# EAGLE design Grove - Magnetic Switch v1.3 (EAGLE 6.5.0)

## Sheet 1 of 2
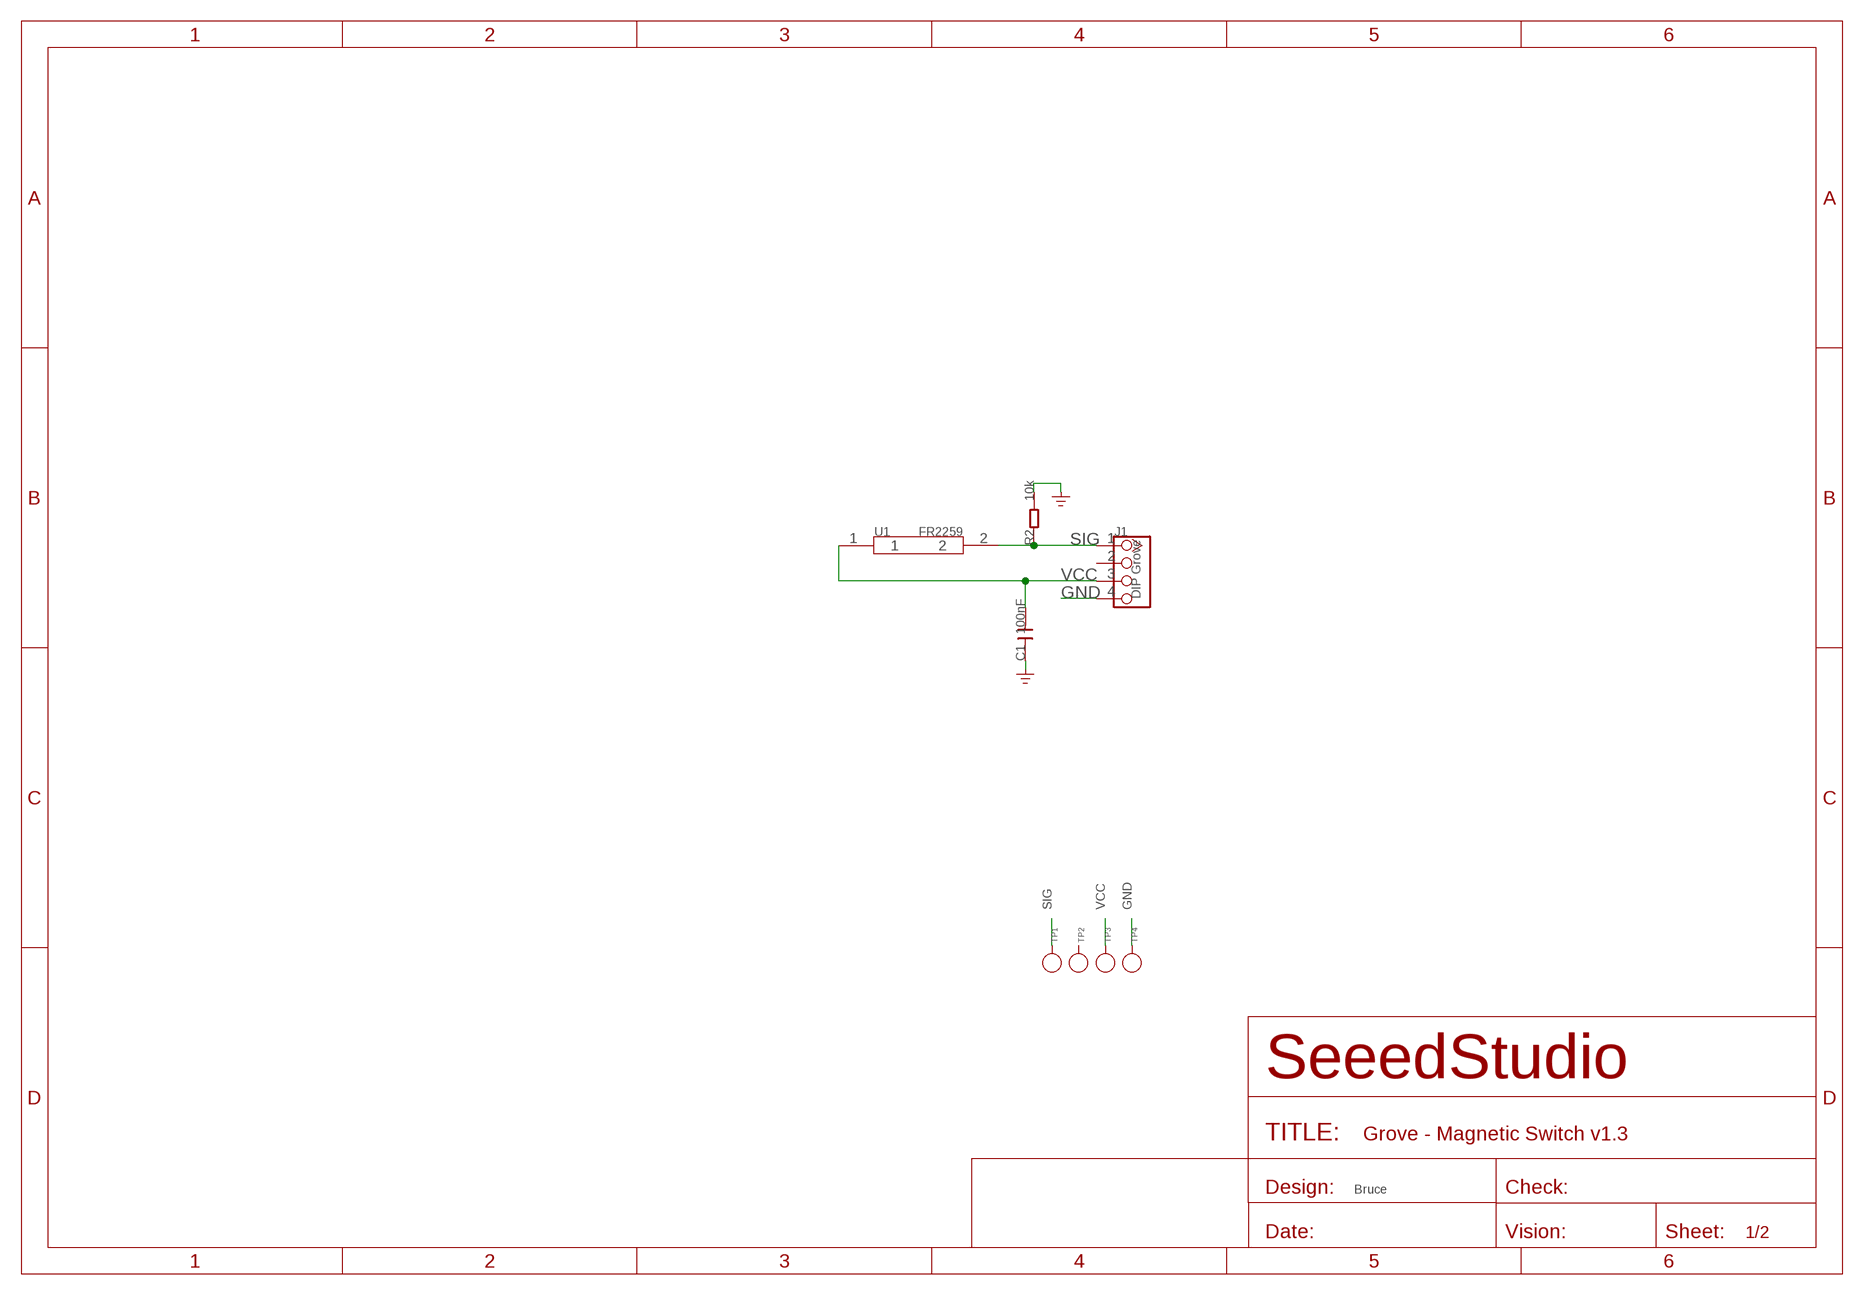
[diagram p0: schematic, sheet 1]

### Parts
C1  100nF  C-0603  [C0603]
J1  DIP Grove  TWIG-4P-2.0-2.0  [4P-2.0]
R2  10k  R-0603  [R0603]
TP1  PAD-TEST-POINT'4545'  [TP_4545]
TP2  PAD-TEST-POINT'4545'  [TP_4545]
TP3  PAD-TEST-POINT'4545'  [TP_4545]
TP4  PAD-TEST-POINT'4545'  [TP_4545]
U1  FR2259  MAGNETISM  [MAGNETISM]

### Nets
GND: C1.1 J1.4 R2.2 TP4.T
SIG: J1.1 R2.1 TP1.T U1.2
VCC: C1.2 J1.3 TP3.T U1.1
Unconnected: J1.2 TP2.T

### Notes on the sheet
- Bruce

## Sheet 2 of 2
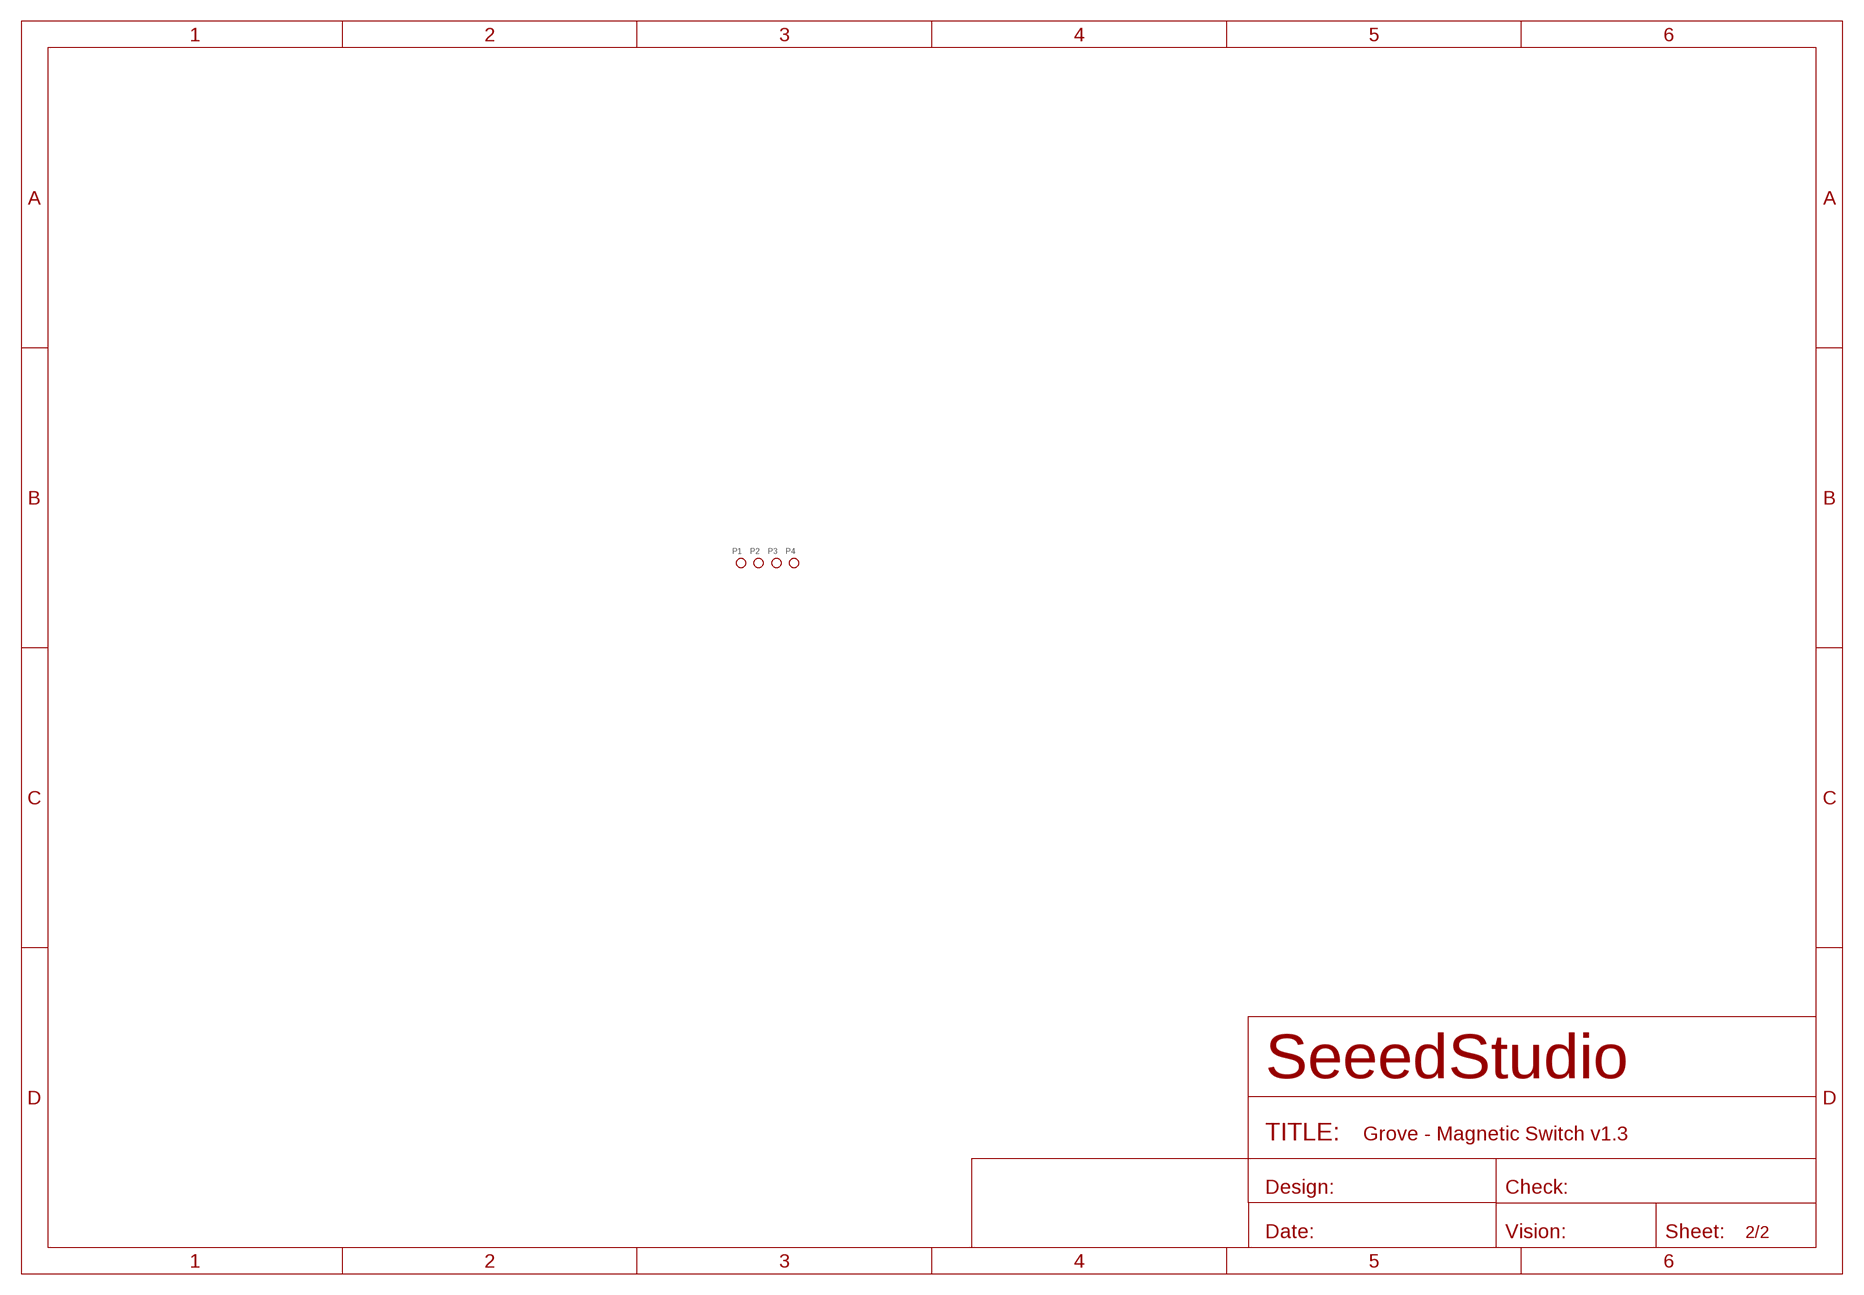
[diagram p1: schematic, sheet 2]

### Parts
P1  PAD-MARK  [ROUND-MARK-1.0]
P2  PAD-MARK  [ROUND-MARK-1.0]
P3  PAD-MARK  [ROUND-MARK-1.0]
P4  PAD-MARK  [ROUND-MARK-1.0]

## Library data of the parts
C1 = Discrete:C*: Ceramic Capacitors
J1 = Connector:TWIG-4P-2.0
P1-P4 = Discrete:PAD-MARK; PARTNO: DNP
R2 = Discrete:R*
TP1-TP4 = Discrete:PAD-TEST-POINT; PARTNO: DNP
U1 = template:MAGNETISM

## Board
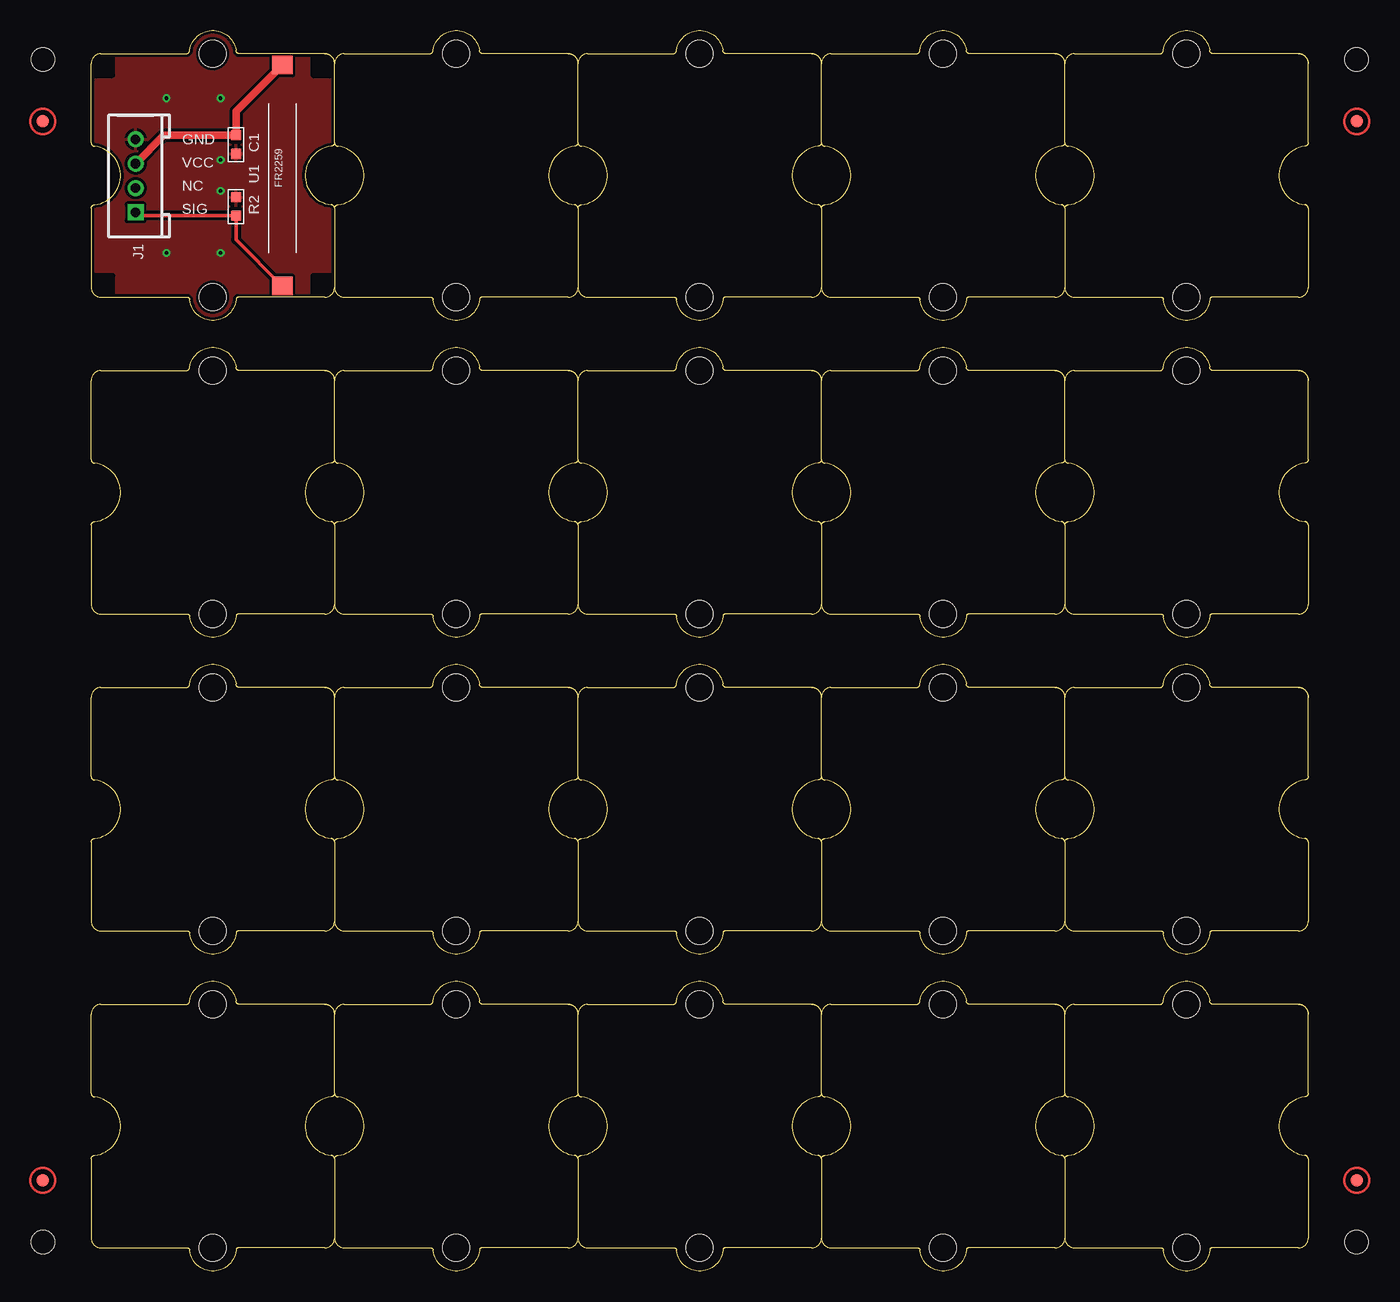
[diagram p2: board, top side]
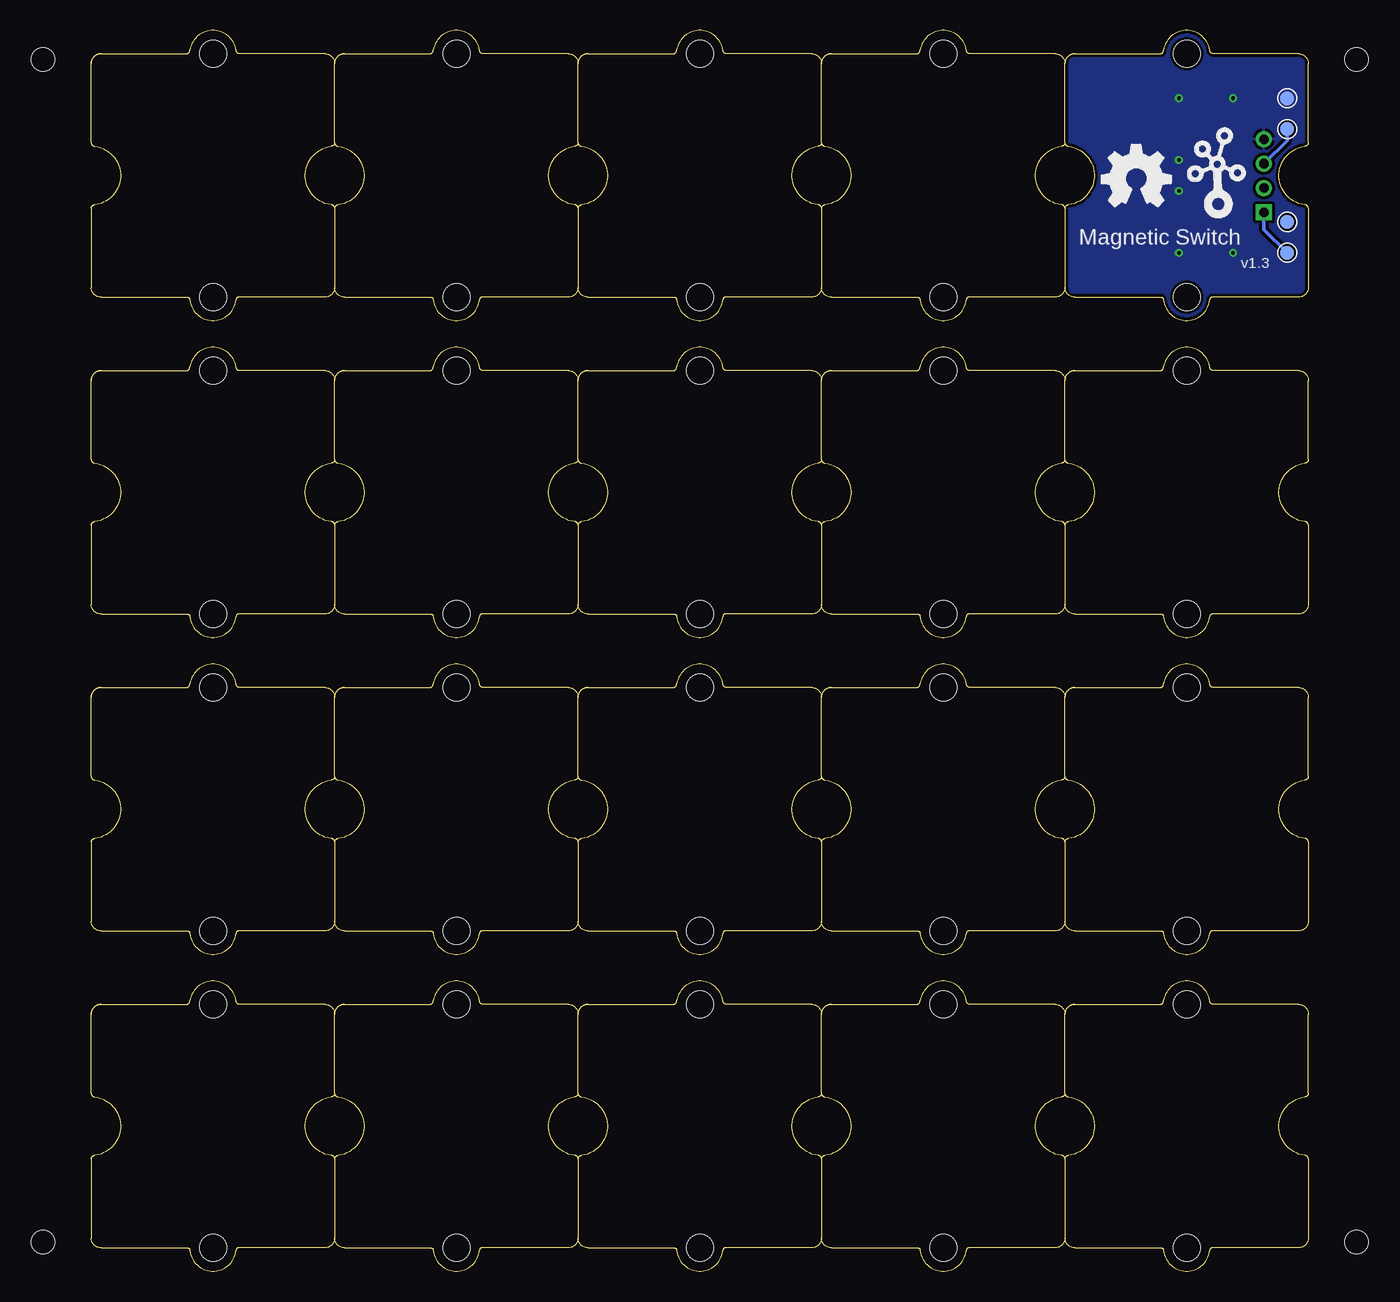
[diagram p3: board, bottom side, seen from below]

Size 100 x 101.93 mm. Coordinates in mm from the lower left corner, seen from the top.
Copper layers (1*16): Top 0.035mm / dielectric 1.5mm / Bottom 0.035mm
Design rules "SeeedStudio_rule_no_angle_090911 *": minimum track width 6mil, minimum drill 12mil, track to track 6mil, track to pad 6mil, pad to pad 6mil, via to via 6mil, smd to smd 0mil, copper to edge 10mil, drill to drill 10mil, minimum pad ring 10mil, minimum via ring 6mil, stop-mask expansion 2mil, vias tented up to drill 100mil, thermal gap 10mil
Holes 1.91 mm at -3.97,2.38 -3.97,99.54 103.98,99.54 103.98,2.38

### Footprints (pad centres in the part's own frame; a part is rotated, then mirrored left to right if it is on the bottom)
C0603 = smd 0.889 x 0.889: 1 -0.762,0; 2 0.762,0
4P-2.0 = drill 0.8 pad 1.27 square: 1 -3,0 | drill 0.8 pad 1.27: 2 -1,0; 3 1,0; 4 3,0
ROUND-MARK-1.0 = smd 1.016 x 1.016: P$1 0,0
R0603 = smd 0.889 x 0.889: 1 -0.762,0; 2 0.762,0
TP_4545 = smd 1.143 x 1.143: T 0,0
MAGNETISM = smd 1.524 x 1.651: 1 -8.89,0; 2 9.271,0
1U-DIM-W/-DRILL = hole 2.2: 0,-10; 0,10

### Placement (x,y rotation side)
C1  11.9,92.55 90 top
J1  3.65,89.99 90 top
P1  -3.97,7.46 0 top  (outside the outline)
P2  103.98,7.46 0 top  (outside the outline)
P3  -3.97,94.46 0 top  (outside the outline)
P4  103.98,94.46 0 top  (outside the outline)
R2  11.9,87.47 90 top
TP1  1.74,83.66 0 bottom
TP2  1.74,86.2 0 bottom
TP3  1.74,93.82 0 bottom
TP4  1.74,96.36 0 bottom
U1  15.71,90.2 270 top
U$1  [TWIGLOGO]  7.46,87.47 0 bottom
U$3  [OSHW_FILLX200_NOTEXT]  16.98,87.47 0 bottom
U$6  [1U-DIM-W/-DRILL]  10,90.01 0 top
U$8  [1U-DIM-W/-DRILL]  10,90.01 0 top
U$9  [1U-DIM-W/-DRILL]  30,90.01 0 top
U$10  [1U-DIM-W/-DRILL]  50,90.01 0 top
U$11  [1U-DIM-W/-DRILL]  70,90.01 0 top
U$12  [1U-DIM-W/-DRILL]  90,90.01 0 top
U$13  [1U-DIM-W/-DRILL]  30,63.98 0 top
U$14  [1U-DIM-W/-DRILL]  50,63.98 0 top
U$15  [1U-DIM-W/-DRILL]  70,63.98 0 top
U$16  [1U-DIM-W/-DRILL]  90,63.98 0 top
U$17  [1U-DIM-W/-DRILL]  10,63.98 0 top
U$18  [1U-DIM-W/-DRILL]  30,37.94 0 top
U$19  [1U-DIM-W/-DRILL]  50,37.94 0 top
U$20  [1U-DIM-W/-DRILL]  70,37.94 0 top
U$21  [1U-DIM-W/-DRILL]  90,37.94 0 top
U$22  [1U-DIM-W/-DRILL]  10,37.94 0 top
U$23  [1U-DIM-W/-DRILL]  30,11.91 0 top
U$24  [1U-DIM-W/-DRILL]  50,11.91 0 top
U$25  [1U-DIM-W/-DRILL]  70,11.91 0 top
U$26  [1U-DIM-W/-DRILL]  90,11.91 0 top
U$27  [1U-DIM-W/-DRILL]  10,11.91 0 top

### Tracks (layer width: path | path; a pad name or v marks a point on that pad's centre or on a via)
GND  (via drill 0.3 pad 0.64)
  other vias: 10.63,91.28 10.63,88.74 10.63,96.36 10.63,83.66 6.19,83.66 6.19,96.36
  pour Top (isolate 0.254): -0.79,102.71 20.8,102.71 20.8,77.31 -0.79,77.31
  pour Bottom (isolate 0.254): -0.79,102.71 20.8,102.71 20.8,77.31 -0.79,77.31
SIG
  Top 0.305: J1.1 3.93,86.71 R2.1 11.9,84.74 U1.2
  Bottom 0.305: J1.1 3.65,85.57 TP1.T
VCC
  Top 0.61: J1.3 5.98,93.32 C1.2 11.9,95.28 U1.1
  Bottom 0.305: TP3.T 1.74,92.89 J1.3

### Text on the board
tPlace: GND | VCC | NC | SIG
bPlace: Magnetic Switch | v1.3